# EAGLE design EBN_Sensors_V02 (EAGLE 7.1.0)
CNAME: EasyBoard Nano; CREVISION: 1; DESIGNER: Martin Olejar
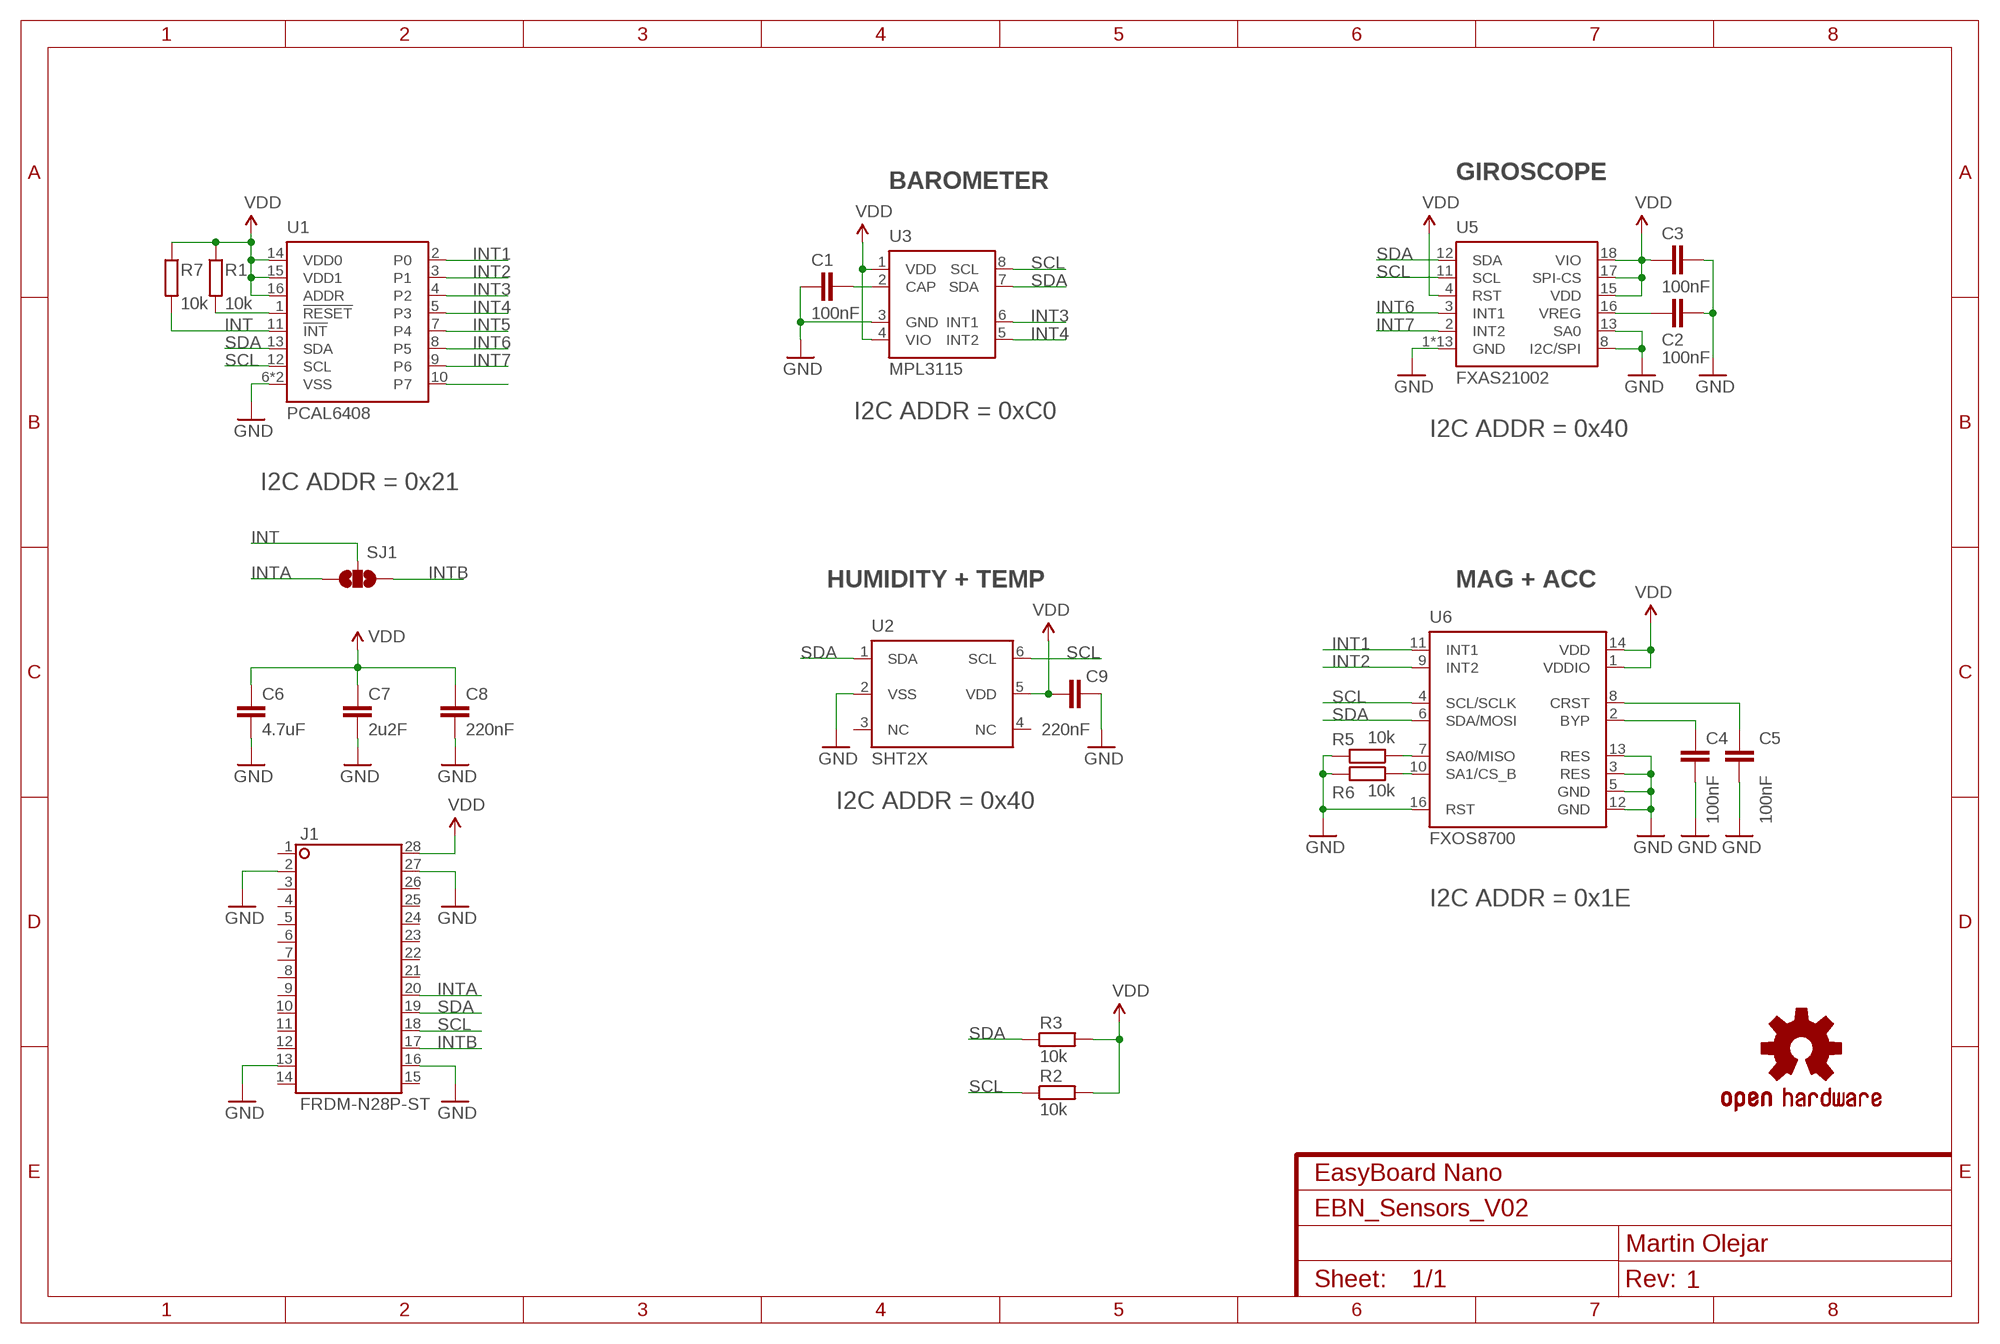
[diagram p0: schematic, sheet 1]

## Parts
C1  100nF  C-EUC0402  [C0402]
C2  100nF  C-EUC0402  [C0402]
C3  100nF  C-EUC0402  [C0402]
C4  100nF  C-EUC0402  [C0402]
C5  100nF  C-EUC0402  [C0402]
C6  4.7uF  C-EUC0603  [C0603]
C7  2u2F  C-EUC0603  [C0603]
C8  220nF  C-EUC0402  [C0402]
C9  220nF  C-EUC0402  [C0402]
J1  FRDM-N28P-ST  [FRDM-N28P-SHIELD]
LOGO1  OSHW-LOGOS  [OSHW-LOGO-S]
R1  10k  R-EUR0402  [R0402]
R2  10k  R-EUR0402  [R0402]
R3  10k  R-EUR0402  [R0402]
R5  10k  R-EUR0402  [R0402]
R6  10k  R-EUR0402  [R0402]
R7  10k  R-EUR0402  [R0402]
SJ1  SJ2W-S  [JUMPER-SMD-S2X]
U1  PCAL6408  [QFN16-3X3MM]
U2  SHT2X  [DFN6_3X3]
U3  MPL3115  [LGA-8]
U5  FXAS21002  [QFN24]
U6  FXOS8700  [QFN16-FX]

## Nets
GND: C1.1 C2.1 C3.1 C4.2 C5.2 C6.2 C7.2 C8.2 C9.1 J1.2 J1.13 J1.16 J1.27 R5.2 R6.2 U1.6(VSS) U1.EXT(VSS) U2.2(VSS) U3.3(GND) U5.1(GND) U5.5(GND) U5.6(GND) U5.7(GND) U5.8(I2C/SPI) U5.9(GND) U5.10(GND) U5.13(SA0) U5.14(GND) U5.19(GND) U5.20(GND) U5.21(GND) U5.22(GND) U5.23(GND) U5.24(GND) U6.3(RES) U6.5(GND) U6.12(GND) U6.13(RES) U6.16(RST)
INT: R7.2 SJ1.2 U1.11(!INT)
INT1: U1.2(P0) U6.11(INT1)
INT2: U1.3(P1) U6.9(INT2)
INT3: U1.4(P2) U3.6(INT1)
INT4: U1.5(P3) U3.5(INT2)
INT5: U1.7(P4)
INT6: U1.8(P5) U5.3(INT1)
INT7: U1.9(P6) U5.2(INT2)
INTA: J1.20 SJ1.3
INTB: J1.17 SJ1.1
N$1: R5.1 U6.7(SA0/MISO)
N$2: R6.1 U6.10(SA1/CS_B)
N$8: U1.10(P7)
N$9: C2.2 U5.16(VREG)
N$10: R1.2 U1.1(!RESET)
N$11: C1.2 U3.2(CAP)
N$16: C4.1 U6.2(BYP)
N$17: C5.1 U6.8(CRST)
SCL: J1.18 R2.1 U1.12(SCL) U2.6(SCL) U3.8(SCL) U5.11(SCL) U6.4(SCL/SCLK)
SDA: J1.19 R3.1 U1.13(SDA) U2.1(SDA) U3.7(SDA) U5.12(SDA) U6.6(SDA/MOSI)
VDD: C3.2 C6.1 C7.1 C8.1 C9.2 J1.28 R1.1 R2.2 R3.2 R7.1 U1.14(VDD0) U1.15(VDD1) U1.16(ADDR) U2.5(VDD) U3.1(VDD) U3.4(VIO) U5.4(RST) U5.15(VDD) U5.17(SPI-CS) U5.18(VIO) U6.1(VDDIO) U6.14(VDD)
Unconnected: J1.1 J1.3 J1.4 J1.5 J1.6 J1.7 J1.8 J1.9 J1.10 J1.11 J1.12 J1.14 J1.15 J1.21 J1.22 J1.23 J1.24 J1.25 J1.26 U2.3(NC) U2.4(NC)

## Notes on the sheet
- GIROSCOPE
- BAROMETER
- I2C ADDR = 0xC0
- I2C ADDR = 0x40
- I2C ADDR = 0x21
- HUMIDITY + TEMP | MAG + ACC
- I2C ADDR = 0x40
- I2C ADDR = 0x1E

## Library data of the parts
C1-C9 = atomx_RLC:C-EU: CAPACITOR, European symbol
J1 = atomx_Boards:FRDM-N28P: Dual In Line
LOGO1 = atomx_Common:OSHW-LOGO: Open Source Hardware Logo This logo indicates the piece of hardware it is found on incorporates a OSHW license and/or adheres to the definition of open source hardware found here: http://freedomdefined.org/OSHW
R1-R3 R5-R7 = atomx_RLC:R-EU: RESISTOR, European symbol
SJ1 = atomx_Connectors:SJ2W: SMD solder JUMPER
U1 = atomx_Sensors:PCAL6408
U2 = atomx_Sensors:SHT2X
U3 = atomx_Sensors:MPL3115
U5 = atomx_Sensors:FXAS21002
U6 = atomx_Sensors:FXOS8700

## Board
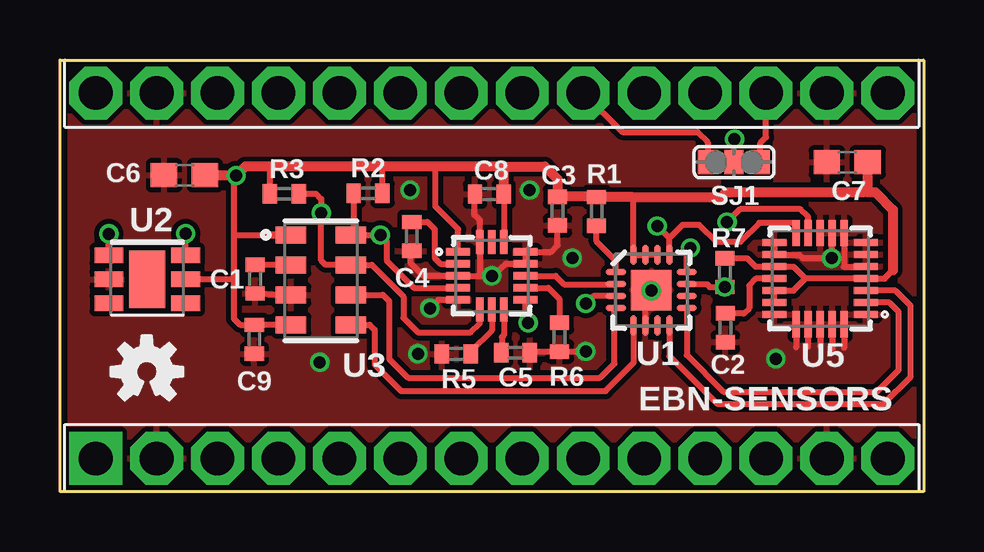
[diagram p1: board, top side]
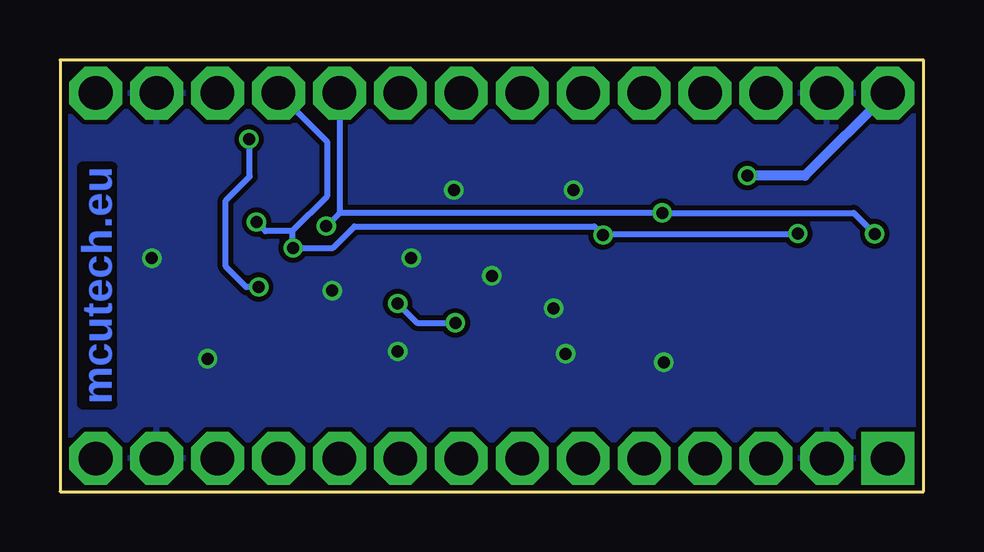
[diagram p2: board, bottom side, seen from below]

Size 36 x 18 mm. Coordinates in mm from the lower left corner, seen from the top.
Copper layers (1*16): Top 0.035mm / dielectric 1.5mm / Bottom 0.035mm
Design rules "ITEADstudio_DRC *": minimum track width 6mil, minimum drill 12mil, track to track 8mil, track to pad 8mil, pad to pad 8mil, via to via 8mil, smd to smd 0mil, copper to edge 10mil, drill to drill 10mil, minimum pad ring 10mil, minimum via ring 6mil, stop-mask expansion 2mil, vias tented up to drill 100mil, thermal gap 8mil

### Footprints (pad centres in the part's own frame; a part is rotated, then mirrored left to right if it is on the bottom)
C0402 = smd 0.6 x 0.8: 1 -0.6,0; 2 0.6,0
C0603 = smd 1.1 x 1: 1 -0.85,0; 2 0.85,0
FRDM-N28P-SHIELD = drill 1.4 pad 2.2 square: 1 -16.51,-7.62 | drill 1.4 pad 2.2 octagon: 2 -13.97,-7.62; 3 -11.43,-7.62; 4 -8.89,-7.62; 5 -6.35,-7.62; 6 -3.81,-7.62; 7 -1.27,-7.62; 8 1.27,-7.62; 9 3.81,-7.62; 10 6.35,-7.62; 11 8.89,-7.62; 12 11.43,-7.62; 13 13.97,-7.62; 14 16.51,-7.62; 15 16.51,7.62; 16 13.97,7.62; 17 11.43,7.62; 18 8.89,7.62; 19 6.35,7.62; 20 3.81,7.62; 21 1.27,7.62; 22 -1.27,7.62; 23 -3.81,7.62; 24 -6.35,7.62; 25 -8.89,7.62; 26 -11.43,7.62; 27 -13.97,7.62; 28 -16.51,7.62
R0402 = smd 0.6 x 0.8: 1 -0.6,0; 2 0.6,0
JUMPER-SMD-S2X = smd 0.8 x 1: 1 -1.1,0; 2 0,0; 3 1.1,0
QFN16-3X3MM = smd 0.85 x 0.28: 1 -1.475,0.75; 2 -1.475,0.25; 3 -1.475,-0.25; 4 -1.475,-0.75; 9 1.475,-0.75; 10 1.475,-0.25; 11 1.475,0.25; 12 1.475,0.75 | smd 0.28 x 0.85: 5 -0.75,-1.475; 6 -0.25,-1.475; 7 0.25,-1.475; 8 0.75,-1.475; 13 0.75,1.475; 14 0.25,1.475; 15 -0.25,1.475; 16 -0.75,1.475 | smd 1.68 x 1.68: EXT 0,0
DFN6_3X3 = smd 0.65 x 1.2: 1 -1,-1.6; 2 0,-1.6; 3 1,-1.6; 4 1,1.6; 5 0,1.6; 6 -1,1.6 | smd 2.4 x 1.5: SH 0,0
LGA-8 = smd 1.27 x 0.7: 1 -1.25,1.9; 2 -1.25,0.65; 3 -1.25,-0.6; 4 -1.25,-1.85; 5 1.25,-1.85; 6 1.25,-0.6; 7 1.25,0.65; 8 1.25,1.9
QFN24 = smd 1 x 0.3: 1 -1.9,1.5; 2 -1.9,1; 3 -1.9,0.5; 4 -1.9,0; 5 -1.9,-0.5; 6 -1.9,-1; 7 -1.9,-1.5; 13 1.9,-1.5; 14 1.9,-1; 15 1.9,-0.5; 16 1.9,0; 17 1.9,0.5; 18 1.9,1; 19 1.9,1.5 | smd 0.3 x 1.1: 8 -1,-1.9; 9 -0.5,-1.9; 10 0,-1.9; 11 0.5,-1.9; 12 1,-1.9; 20 1,1.9; 21 0.5,1.9; 22 0,1.9; 23 -0.5,1.9; 24 -1,1.9
QFN16-FX = smd 1 x 0.3: 1 -1.4,1; 2 -1.4,0.5; 3 -1.4,0; 4 -1.4,-0.5; 5 -1.4,-1; 9 1.4,-1; 10 1.4,-0.5; 11 1.4,0; 12 1.4,0.5; 13 1.4,1 | smd 0.3 x 1: 6 -0.5,-1.4; 7 0,-1.4; 8 0.5,-1.4; 14 0.5,1.4; 15 0,1.4; 16 -0.5,1.4

### Placement (x,y rotation side)
C1  8.14,8.86 90 top
C2  27.74,6.83 90 top
C3  20.74,11.7 90 top
C4  14.67,10.64 270 top
C5  18.99,5.79 0 top
C6  5.19,13.19 180 top
C7  32.82,13.73 180 top
C8  17.9,12.41 180 top
C9  8.1,6.35 90 top
J1  18,9 0 top
LOGO1  3.62,5 0 top
R1  22.37,11.68 270 top
R2  12.84,12.44 0 top
R3  9.35,12.42 180 top
R5  16.52,5.74 180 top
R6  20.82,6.44 270 top
R7  27.72,9.13 270 top
SJ1  28.1,13.73 180 top
U1  24.65,8.4 0 top
U2  3.64,8.85 270 top
U3  10.88,8.8 0 top
U5  31.69,8.88 180 top
U6  18,9 0 top

### Tracks (layer width: path | path; a pad name or v marks a point on that pad's centre or on a via)
GND  (via drill 0.5)
  Top 0.254: C4.2 14.62,10.09 14.62,9.54 15.16,9 U6.3 17.52,9 | U6.5 15.78,8 v15.42,7.64 | C5.2 19.64,5.84 R6.2 v21.92,5.84 | 17.52,9 17.96,9 arc-90 v18,9 18.58,9.5 U6.12 U6.13 20.46,10 20.74,10.28 C3.1 | 17.52,9 17.5,9.02 U6.16 17.5,11.33 17.28,11.55 17.28,12.24 C8.2 | C1.1 U3.3 | U5.13 U5.14 30.82,9.87 30.96,9.73 v32.17,9.73 U5.9 | U5.20 30.69,6.02 | U5.21 31.18,6.05 | 31.69,7.17 31.69,6.07 31.7,6.06 | 32.19,7.16 32.19,5.99 32.2,5.98 | 32.69,7.14 32.69,5.99 | U1.6 24.4,8.38 v24.65,8.38 | U5.8 32.69,9.4 32.66,9.37 U5.5
  other vias: 14.92,5.75 29.84,5.54 14.59,12.57 10.83,5.39 19.58,12.57 21.36,9.74
  pour Top: 0.01,17.99 35.99,17.99 35.99,0.01 0.01,0.01
  pour Bottom: 0.01,17.99 35.99,17.99 35.99,0.01 0.01,0.01
INT  (via drill 0.5)  (1 unrouted)
  Top 0.254: SJ1.2 28.1,14.68 v28.12,14.7 | U1.11 26.97,8.65 27.09,8.53 R7.2
  Bottom 0.254: v28.12,14.7 28.09,14.67 28.09,13.14 29.09,12.14 29.09,9.39 28.23,8.53 v27.71,8.53
INT1
  Top 0.254: U6.11 20.66,9 21.02,8.64 U1.2
INT2  (via drill 0.5)
  Top 0.254: v19.52,7.04 19.4,7.16 U6.9 | U1.3 22.23,8.15 v21.92,7.84
  Bottom 0.254: v21.92,7.84 21.12,7.04 v19.52,7.04
INT3
  Top 0.254: U3.6 13.46,8.2 13.72,7.94 13.72,5.54 14.52,4.74 22.52,4.74 23.12,5.34 23.12,7.59 U1.4
INT4
  Top 0.254: U3.5 12.91,6.95 13.12,6.74 13.12,5.3 14.22,4.19 22.74,4.19 23.92,5.38 23.92,6.4 U1.5
INT6
  Top 0.254: U1.8 25.4,5.65 27.4,3.66 34.33,3.66 35.46,4.79 35.46,7.75 34.83,8.38 U5.3
INT7
  Top 0.254: U1.9 26.12,5.69 27.66,4.16 34.05,4.16 34.96,5.07 34.96,7.5 34.58,7.88 U5.2
INTA
  Top 0.254: J1.20 23.44,14.99 26.58,14.99 27,14.57 SJ1.3
INTB
  Top 0.254: SJ1.1 29.2,14.55 29.43,14.78 J1.17
N$1
  Top 0.254: U6.7 18,6.72 17.12,5.84 R5.1
N$2
  Top 0.254: U6.10 20.36,8.5 20.82,8.04 R6.1
N$9
  Top 0.254: U5.16 29.02,8.88 28.73,8.59 28.73,7.64 28.51,7.42 C2.2
N$10
  Top 0.254: U1.1 23.18,9.62 22.37,10.43 R1.2
N$11
  Top 0.254: U3.2 7.91,9.45 C1.2
N$16
  Top 0.254: C4.1 15.32,11.24 15.62,10.94 15.62,9.74 15.86,9.5 U6.2
N$17
  Top 0.254: U6.8 18.5,6.52 18.42,6.44 18.42,5.82 C5.1
SCL  (via drill 0.5)
  Top 0.254: U3.8 v13.36,10.7 13.62,10.44 13.62,9.64 14.76,8.5 U6.4 | U5.11 31.19,11.46 30.87,11.78 28.35,11.78 v27.81,11.24 | U1.12 26.12,10 v26.28,10.16 | 12.09,10.74 U3.8 | U2.6 v5.24,10.76 | R2.1 12.24,10.81 U3.8
  Bottom 0.254: J1.18 24.87,14.6 24.87,12.31 26.32,10.86 | 26.32,10.86 26.32,10.16 v26.28,10.16 24.62,10.16 23.72,11.06 13.72,11.06 v13.36,10.7 13.36,10.73 5.24,10.73 v5.24,10.76 | 26.32,10.86 27.43,10.86 v27.81,11.24
SDA  (via drill 0.5)
  Top 0.254: U6.6 17.5,7.02 17.12,6.64 14.92,6.64 14.32,7.24 14.32,8.14 13.01,9.45 U3.7 11.08,9.45 10.89,9.64 v10.89,11.62 10.89,12.2 10.67,12.42 R3.1 | U1.13 25.4,10.57 | 25.4,10.57 v24.9,11.07 | 25.4,10.57 25.95,11.12 26.64,11.12 27.34,10.42 28.37,10.42 29.15,11.2 30.69,11.2 U5.12 | U2.1 v2.04,10.75
  Bottom 0.254: J1.19 24.35,11.62 | 24.35,11.62 v24.9,11.07 | 24.35,11.62 v10.89,11.62 2.91,11.62 v2.04,10.75
VDD  (via drill 0.5)
  Top 0.254: U3.4 C9.2 | C9.2 7.88,6.95 | 7.25,8.86 7.25,7.2 7.5,6.95 C9.2 | 8.45,10.7 7.3,10.7 7.25,10.65 | U5.18 U5.17 30.58,8.38 31.08,8.88 | 33.67,8.88 U5.4 | 31.08,8.88 30.58,9.38 U5.15 28.99,9.38 28.64,9.73 R7.1 | U5.4 31.08,8.88 | U5.4 34.37,8.88 34.72,9.23 | C8.1 U6.14 | U6.1 16.6,10.94 15.65,11.89 15.65,13.5 15.59,13.56 | 23.88,12.28 23.9,12.26 U1.16 U1.15 U1.14 | U2.5 7.25,8.86 | 7.25,8.86 7.25,10.65 | 7.25,10.65 7.25,13.09 v7.34,13.18 | R3.2 8.75,13.53 8.72,13.56 | R2.2 13.44,13.47 13.53,13.56
  Top 0.305: 8.45,10.7 U3.1
  Top 0.406: 33.67,12.68 33.67,12.48 33.99,12.48 34.72,11.75 34.72,9.23 | 33.67,12.68 C7.1 | 18.5,13.56 15.59,13.56 13.53,13.56 8.72,13.56 7.72,13.56 v7.34,13.18 v7.33,13.19 C6.1 | C3.2 20.72,12.32 | C8.1 18.5,13.56 | C3.2 22.35,12.3 R1.1 23.88,12.28 27.57,12.28 27.77,12.48 33.47,12.48 33.67,12.68 | 18.5,13.56 20.21,13.56 20.74,13.03 C3.2
  Bottom 0.406: J1.28 4.94,13.17 v7.34,13.18

### Text on the board
Bottom: mcutech.eu
tPlace: EBN-SENSORS